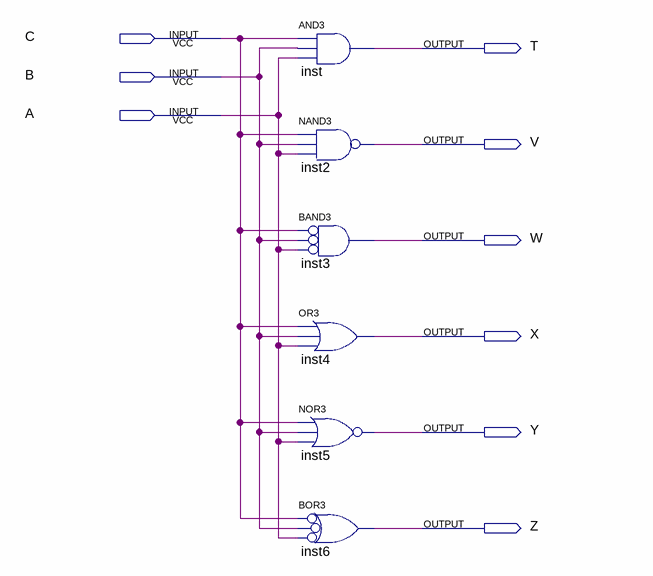
[diagram p0: schematic sheet]
// Quartus schematic FDD_Lab2.bdf as structural Verilog: 6 symbols, 9 pins
module FDD_Lab2 (
  input  C,
  input  B,
  input  A,
  output T,
  output V,
  output W,
  output X,
  output Y,
  output Z
);

  and inst (T, C, B, A);
  nand inst2 (V, C, B, A);
  and inst3 (W, ~C, ~B, ~A);  // BAND3
  or inst4 (X, C, B, A);
  nor inst5 (Y, C, B, A);
  or inst6 (Z, ~C, ~B, ~A);  // BOR3
endmodule
